# Altium schematic sheet Sheet2.SchDoc
size A4
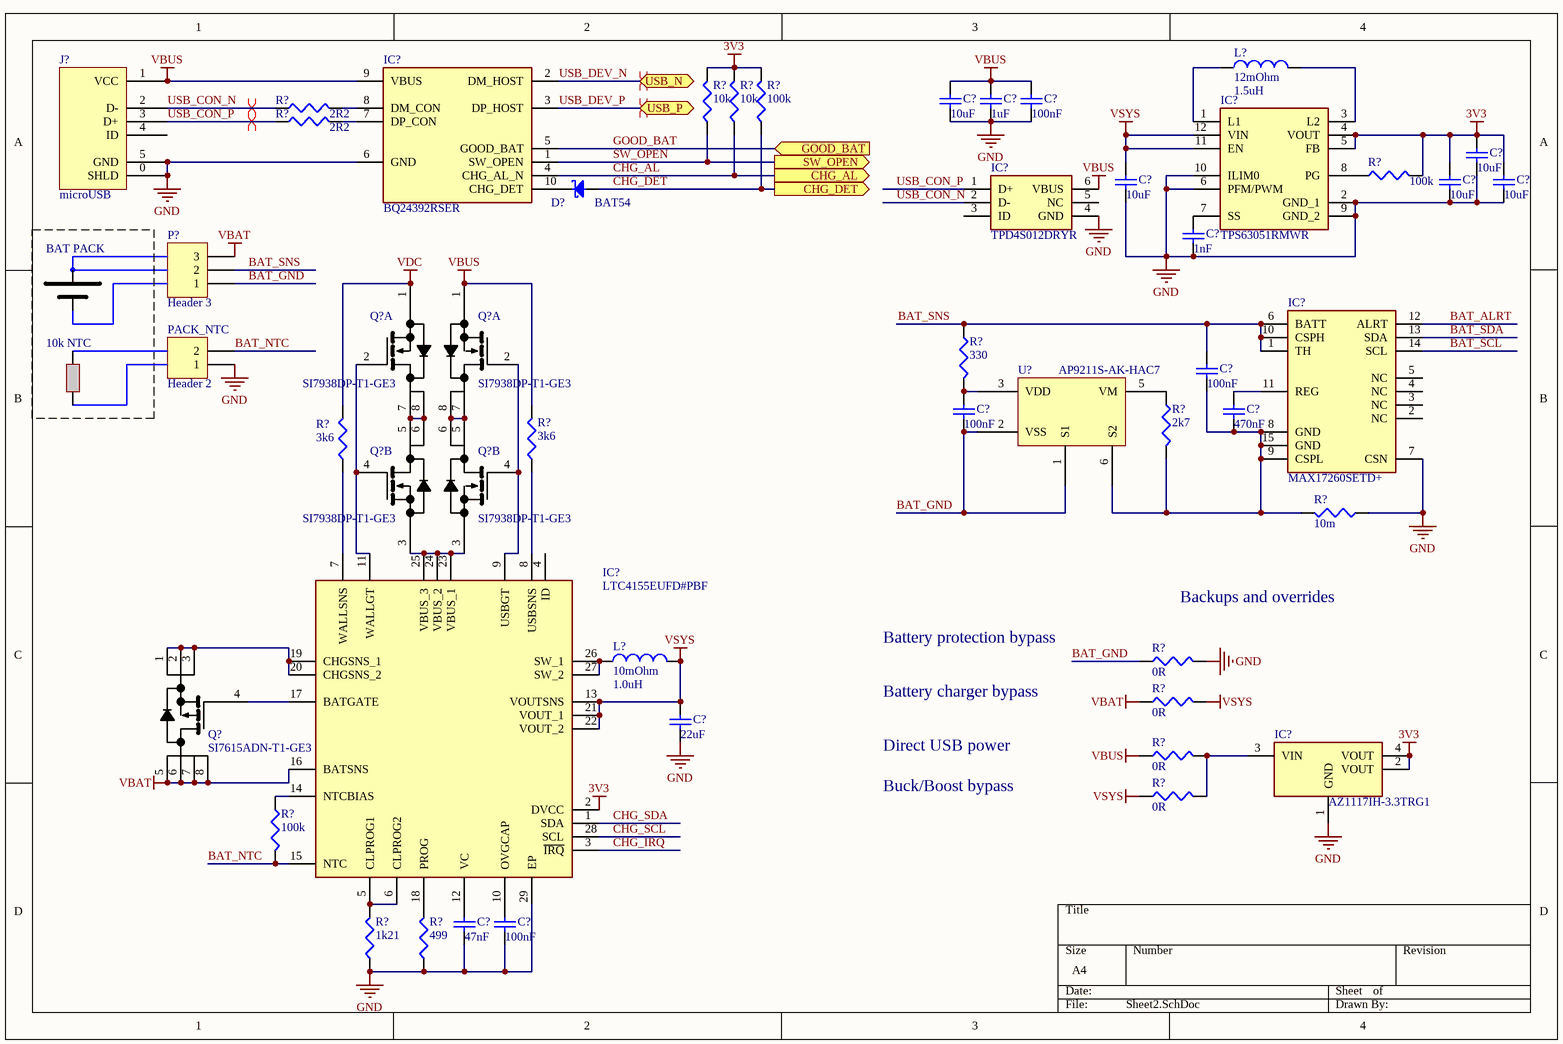
[diagram p0: Sheet2.SchDoc]

## Parts
(Parts that share a designator on the sheet are numbered #1, #2 ... from top to bottom, then left to right.)
C?#1  value 10uF  [1608[0603]]  (hidden comment: Cap Semi)
C?#2  value 1uF  [1608[0603]]  (hidden comment: Cap Semi)
C?#3  value 100nF  [1608[0603]]  (hidden comment: Cap Semi)
C?#4  value 10uF  [1608[0603]]  (hidden comment: Cap Semi)
C?#5  value 10uF  [1608[0603]]  (hidden comment: Cap Semi)
C?#6  value 10uF  [1608[0603]]  (hidden comment: Cap Semi)
C?#7  value 10uF  [1608[0603]]  (hidden comment: Cap Semi)
C?#8  value 1nF  [1608[0603]]  (hidden comment: Cap Semi)
C?#9  value 100nF  [1608[0603]]  (hidden comment: Cap Semi)
C?#10  value 100nF  [1608[0603]]  (hidden comment: Cap Semi)
C?#11  value 470nF  [1608[0603]]  (hidden comment: Cap Semi)
C?#12  value 22uF  [1608[0603]]  (hidden comment: Cap Semi)
C?#13  value 47nF  [1608[0603]]  (hidden comment: Cap Semi)
C?#14  value 100nF  [1608[0603]]  (hidden comment: Cap Semi)
D?  BAT54  [SOT95P240X130-3N]
IC?#1  BQ24392RSER  [RSE(R-PUQFN-N10)]
IC?#2  TPS63051RMWR  [QFN50P250X250X100-12N-D]
IC?#3  TPD4S012DRYR  [SON50P100X145X60-6N]
IC?#4  MAX17260SETD+  [SON40P300X300X80-15N]
IC?#5  LTC4155EUFD#PBF  [QFN50P400X500X80-29N-D]
IC?#6  AZ1117IH-3.3TRG1  [SOT230P700X170-4N]
J?  microUSB  [UB-MC5BR3-SDWP604-4S - custom]
L?#1  12mOhm  value 1.5uH  [INDP2523X23N]
L?#2  10mOhm  value 1.0uH  [INDP2523X23N]
P?  Header 3  [HDR1X3]
PACK_NTC  Header 2  [HDR1X2]
Q?#1  SI7938DP-T1-GE3  [POWERPAK-SO8_1]  (part A of 2)
Q?#2  SI7938DP-T1-GE3  [POWERPAK-SO8_1]  (part A of 2)
Q?#3  SI7938DP-T1-GE3  [POWERPAK-SO8_1]  (part B of 2)
Q?#4  SI7938DP-T1-GE3  [POWERPAK-SO8_1]  (part B of 2)
Q?#5  SI7615ADN-T1-GE3  [PowerPAK1212-8 Single]
R?#1  value 2R2  [J1-0603]  (hidden comment: Res3)
R?#2  value 2R2  [J1-0603]  (hidden comment: Res3)
R?#3  value 10k  [J1-0603]  (hidden comment: Res3)
R?#4  value 10k  [J1-0603]  (hidden comment: Res3)
R?#5  value 100k  [J1-0603]  (hidden comment: Res3)
R?#6  value 100k  [J1-0603]  (hidden comment: Res3)
R?#7  value 330  [J1-0603]  (hidden comment: Res3)
R?#8  value 2k7  [J1-0603]  (hidden comment: Res3)
R?#9  value 3k6  [J1-0603]  (hidden comment: Res3)
R?#10  value 3k6  [J1-0603]  (hidden comment: Res3)
R?#11  value 10m  [RESC3216X80N]  (hidden comment: Res3)
R?#12  value 0R  [J1-0603]  (hidden comment: Res3)
R?#13  value 0R  [J1-0603]  (hidden comment: Res3)
R?#14  value 0R  [J1-0603]  (hidden comment: Res3)
R?#15  value 0R  [J1-0603]  (hidden comment: Res3)
R?#16  value 100k  [J1-0603]  (hidden comment: Res3)
R?#17  value 1k21  [J1-0603]  (hidden comment: Res3)
R?#18  value 499  [J1-0603]  (hidden comment: Res3)
U?  AP9211S-AK-HAC7  [U-DFN2030-6]

## Ports
CHG_AL (out), CHG_DET (out), GOOD_BAT (in), SW_OPEN (out), USB_N (bidir), USB_P (bidir)

## Nets
3V3: C?#4.2 C?#6.2 C?#7.2 IC?#2.4(VOUT) IC?#2.5(FB) IC?#5.2(DVCC) IC?#6.2(VOUT) IC?#6.4(VOUT) R?#3.2 R?#4.2 R?#5.2 R?#6.2
GND: C?#1.1 C?#2.1 C?#3.1 C?#4.1 C?#5.1 C?#6.1 C?#7.1 C?#8.1 C?#12.1 C?#13.1 C?#14.1 IC?#1.6(GND) IC?#2.2(GND_1) IC?#2.6(PFM/PWM) IC?#2.9(GND_2) IC?#2.10(ILIM0) IC?#3.4(GND) IC?#4.7(CSN) IC?#5.29(EP) IC?#6.1(GND) J?.0(SHLD) J?.5(GND) PACK_NTC.1 R?#11.1 R?#12.2 R?#17.1 R?#18.1
VBAT: IC?#5.16(BATSNS) P?.3 Q?#5.5(D) Q?#5.6(D) Q?#5.7(D) Q?#5.8(D) R?#13.1
VBUS: C?#1.2 C?#2.2 C?#3.2 IC?#1.9(VBUS) IC?#3.6(VBUS) J?.1(VCC) Q?#2.1(S1) R?#10.2 R?#14.1
VDC: Q?#1.1(S1) R?#9.2
VSYS: C?#5.2 C?#12.2 IC?#2.11(EN) IC?#2.12(VIN) IC?#5.13(VOUTSNS) IC?#5.21(VOUT_1) IC?#5.22(VOUT_2) L?#2.2 R?#13.2 R?#15.1
BAT_ALRT: IC?#4.12(ALRT)
BAT_GND: C?#10.1 P?.1 R?#12.1 U?.1(S1) U?.2(VSS)
BAT_NTC: IC?#5.15(NTC) PACK_NTC.2 R?#16.2
BAT_SCL: IC?#4.14(SCL)
BAT_SDA: IC?#4.13(SDA)
BAT_SNS: C?#9.2 IC?#4.1(TH) IC?#4.6(BATT) IC?#4.10(CSPH) P?.2 R?#7.1
CHG_AL: IC?#1.4(CHG_AL_N) R?#4.1 ; port CHG_AL
CHG_DET: D?.1(A) R?#5.1 ; port CHG_DET
CHG_IRQ: IC?#5.3(~{IRQ})
CHG_SCL: IC?#5.28(SCL)
CHG_SDA: IC?#5.1(SDA)
GOOD_BAT: IC?#1.5(GOOD_BAT) ; port GOOD_BAT
SW_OPEN: IC?#1.1(SW_OPEN) R?#3.1 ; port SW_OPEN
USB_CON_N: IC?#3.2(D-) J?.2(D-) R?#1.1
USB_CON_P: IC?#3.1(D+) J?.3(D+) R?#2.1
USB_DEV_N: IC?#1.2(DM_HOST) ; port USB_N
USB_DEV_P: IC?#1.3(DP_HOST) ; port USB_P
NetC?#8_2: C?#8.2 IC?#2.7(SS)
NetC?#9_1: C?#9.1 C?#11.1 IC?#4.8(GND) IC?#4.9(CSPL) IC?#4.15(GND) R?#8.2 R?#11.2 U?.6(S2)
NetC?#10_2: C?#10.2 R?#7.2 U?.3(VDD)
NetC?#11_2: C?#11.2 IC?#4.11(REG)
NetC?#13_2: C?#13.2 IC?#5.12(VC)
NetC?#14_2: C?#14.2 IC?#5.10(OVGCAP)
NetD?_3: D?.3(C) IC?#1.10(CHG_DET)
NetIC?#1_7: IC?#1.7(DP_CON) R?#2.2
NetIC?#1_8: IC?#1.8(DM_CON) R?#1.2
NetIC?#2_1: IC?#2.1(L1) L?#1.1
NetIC?#2_3: IC?#2.3(L2) L?#1.2
NetIC?#2_8: IC?#2.8(PG) R?#6.1
NetIC?#5_5: IC?#5.5(CLPROG1) IC?#5.6(CLPROG2) R?#17.2
NetIC?#5_7: IC?#5.7(WALLSNS) R?#9.1
NetIC?#5_8: IC?#5.8(USBSNS) R?#10.1
NetIC?#5_9: IC?#5.9(USBGT) Q?#2.2(G1) Q?#4.4(G2)
NetIC?#5_11: IC?#5.11(WALLGT) Q?#1.2(G1) Q?#3.4(G2)
NetIC?#5_14: IC?#5.14(NTCBIAS) R?#16.1
NetIC?#5_17: IC?#5.17(BATGATE) Q?#5.4(G)
NetIC?#5_18: IC?#5.18(PROG) R?#18.2
NetIC?#5_19: IC?#5.19(CHGSNS_1) IC?#5.20(CHGSNS_2) Q?#5.1(S) Q?#5.2(S) Q?#5.3(S)
NetIC?#5_23: IC?#5.23(VBUS_1) IC?#5.24(VBUS_2) IC?#5.25(VBUS_3) Q?#3.3(S2) Q?#4.3(S2)
NetIC?#5_26: IC?#5.26(SW_1) IC?#5.27(SW_2) L?#2.1
NetIC?#6_3: IC?#6.3(VIN) R?#14.2 R?#15.2
NetQ?#1_7: Q?#1.7(D1_1) Q?#1.8(D1_2) Q?#3.5(D2_1) Q?#3.6(D2_2)
NetQ?#2_7: Q?#2.7(D1_1) Q?#2.8(D1_2) Q?#4.5(D2_1) Q?#4.6(D2_2)
NetR?#8_1: R?#8.1 U?.5(VM)

Not connected (* = marked no-connect by the designer): IC?#3 3(ID) 5(NC); IC?#4 2(NC) 3(NC) 4(NC) 5(NC); IC?#5 4(ID); J? 4(ID)

## Layout directives
differential pair: USB_CON_N, USB_CON_P, USB_DEV_N, USB_DEV_P

## Notes on the sheet
- BAT PACK
- 10k NTC
- Battery protection bypass
- Backups and overrides
- Battery charger bypass
- Direct USB power
- Buck/Boost bypass

## Library data of the parts
C?#1-C?#14 = Cap Semi: Capacitor (Semiconductor SIM Model); Published: 8-Jun-2000; LatestRevisionDate: 29-May-2009; LatestRevisionNote: IPC-7351 Footprint Added.; PackageReference: C1206; Publisher: Altium Limited; PackageDescription: Chip Capacitor
D? = BAT54: Diode Schottky  Anode Pin 1 Cathode Pin 3 (Pas de pin 2); Part Description: Single Small Signal Schottky Diode; Manufacturer: FAIRCHILD SEMICONDUCTOR; Voltage: 30V; Power: 200mA; PressFit: No; Bonding: No; Part Number: BAT54; Component Kind: Standard; Component Type: Standard; Device: BAT54; PackageDescription: SOT23 3-Leads, Pitch 0.95mm - Body 1.3x2.9mm, IPC Medium Density; Manufacturer Part Number: BAT54; Pin Count: 3; Case: SOT23-3; Mounted: Yes; Socket: No; SMD: Yes; Sense: No; ComponentHeight: 1.30mm; HelpURL: \\cern.ch\dfs\Applications\Altium\Datasheets\BAT54.pdf; Author: CERN DEM JLC; CreateDate: 17.09.2009; LatestRevisionDate: 27.05.2010
IC?#1 = BQ24392RSER: Integrated Circuit; Manufacturer_Name: Texas Instruments; Datasheet Link: http://www.ti.com/lit/gpn/bq24392; Manufacturer_Part_Number: BQ24392RSER; Mouser Part Number: 595-BQ24392RSER; Mouser Price/Stock: https://www.mouser.com/Search/Refine.aspx?Keyword=595-BQ24392RSER; RS Part Number: 8279327; RS Price/Stock: http://uk.rs-online.com/web/p/products/8279327
IC?#2 = TPS63051RMWR: Integrated Circuit; Manufacturer_Name: Texas Instruments; Datasheet Link: http://www.ti.com/lit/gpn/tps63051; Height: 1mm; Manufacturer_Part_Number: TPS63051RMWR; ComponentLink1Description: TPS6305x Datasheet; ComponentLink1URL: http://www.ti.com/lit/ds/symlink/tps63051.pdf
IC?#3 = TPD4S012DRYR: Integrated Circuit; Manufacturer_Name: Texas Instruments; Datasheet Link: http://www.ti.com/lit/ds/symlink/tpd4s012.pdf; Height: 0.6mm; Mouser2 Part Number: 595-TPD4S012DRYR; Mouser2 Price/Stock: https://www.mouser.com/Search/Refine.aspx?Keyword=595-TPD4S012DRYR; Manufacturer_Part_Number: TPD4S012DRYR; ComponentLink1Description: TPD4S012 Datasheet; ComponentLink1URL: http://www.ti.com/lit/ds/symlink/tpd4s012.pdf
IC?#4 = MAX17260SETD+: Integrated Circuit; Manufacturer_Name: Maxim Integrated; Datasheet Link: https://componentsearchengine.com/Datasheets/1/MAX17260SETD+.pdf; Height: 0.8mm; Mouser2 Part Number: 700-MAX17260SETD+; Mouser2 Price/Stock: https://www.mouser.com/Search/Refine.aspx?Keyword=700-MAX17260SETD%2B; Manufacturer_Part_Number: MAX17260SETD+; ComponentLink1Description: MAX17260 Datasheet; ComponentLink1URL: https://datasheets.maximintegrated.com/en/ds/MAX17260.pdf; ComponentLink2Description: MAX17260SETD+ (Mouser); ComponentLink2URL: https://pl.mouser.com/ProductDetail/Maxim-Integrated/MAX17260SETD%2b?qs=sGAEpiMZZMve4%2FbfQkoj%252BAnnYqGcWj2a8PZHpMVmFSA%3D; ComponentLink3Description: MAX17260 User Guide; ComponentLink3URL: https://pdfserv.maximintegrated.com/en/an/MAX1726x-ModelGauge-m5-EZ-user-guide.pdf
IC?#5 = LTC4155EUFD#PBF: Integrated Circuit; Manufacturer_Name: Linear Technology; Datasheet Link: http://www.analog.com/media/en/technical-documentation/data-sheets/4155fd.pdf; Height: 0.8mm; Manufacturer_Part_Number: LTC4155EUFD#PBF
IC?#6 = AZ1117IH-3.3TRG1: Integrated Circuit; Manufacturer_Name: Diodes Inc.; Description: LDO Voltage Regulators LDO BJT HiCurr 1.35A 10Hz to 10KHz; Datasheet Link: https://componentsearchengine.com/Datasheets/1/AZ1117IH-3.3TRG1.pdf; Height: 1.7mm; Mouser2 Part Number: 621-AZ1117IH-3.3TRG1; Mouser2 Price/Stock: https://www.mouser.com/Search/Refine.aspx?Keyword=621-AZ1117IH-3.3TRG1; Manufacturer_Part_Number: AZ1117IH-3.3TRG1
J? = microUSB: microUSB connector
L?#1 = Inductor: Inductor SRN6045TA-1R5Y; Code_IEC: 1005; Published: 8-Jun-2000; LatestRevisionDate: 29-May-2009; LatestRevisionNote: IPC-7351 Footprint Added.; PackageReference: 0402-A; Publisher: Altium Limited; PackageDescription: Chip Inductor; Code_JEITA: 0402; ComponentLink1Description: SRN6045TA-1R5Y (Mouser); ComponentLink1URL: https://pl.mouser.com/ProductDetail/Bourns/SRN6045TA-1R5Y?qs=sGAEpiMZZMsg%252By3WlYCkU3tyM9HcjVri8VL%2FIY%252BgGEQ%3D
L?#2 = Inductor: Inductor SRN6045TA-1R0Y; Code_IEC: 1005; Published: 8-Jun-2000; LatestRevisionDate: 29-May-2009; LatestRevisionNote: IPC-7351 Footprint Added.; PackageReference: 0402-A; Publisher: Altium Limited; PackageDescription: Chip Inductor; Code_JEITA: 0402; ComponentLink2Description: SRN6045-1R0Y (Mouser); ComponentLink2URL: pl.mouser.com/ProductDetail/Bourns/SRN6045-1R0Y?qs=sGAEpiMZZMsg%252By3WlYCkU0o4wAoqWTm0KET%2FFU%252BpntA%3D
P? = Header 3: Header, 3-Pin; LatestRevisionDate: 17-Jul-2002; LatestRevisionNote: Re-released for DXP Platform.; Publisher: Altium Limited
PACK_NTC = Header 2: Header, 2-Pin; LatestRevisionDate: 17-Jul-2002; LatestRevisionNote: Re-released for DXP Platform.; Publisher: Altium Limited
Q?#1-Q?#4 = SI7938DP-T1-GE3: MOSFET (N-Channel); Manufacturer_Name: Vishay; Datasheet Link: https://www.vishay.com/docs/65365/si7938dp.pdf; Manufacturer_Part_Number: SI7938DP-T1-GE3
Q?#5 = SI7615ADN-T1-GE3: MOSFET (P-Channel); Manufacturer_Name: Vishay; Manufacturer_Part_Number: SIS413DN-T1-GE3; ComponentLink1Description: Mouser; ComponentLink1URL: https://pl.mouser.com/ProductDetail/Vishay-Siliconix/SI7615ADN-T1-GE3?qs=sGAEpiMZZMshyDBzk1%2FWi6E1PdrpaYNpUmwK%2FZj1bgw%3D; ComponentLink2Description: Datasheet; ComponentLink2URL: https://pl.mouser.com/datasheet/2/427/si7615cdn-1018932.pdf
R?#1-R?#18 = Res3: Resistor; Published: 8-Jun-2000; LatestRevisionDate: 29-May-2009; LatestRevisionNote: IPC-7351 Footprint Added.; PackageReference: J1-0603; Publisher: Altium Limited; PackageDescription: Chip Resistor
U? = AP9211: SINGLE CHIP SOLUTION FOR 1-CELL Li+ BATTERY PACK; ComponentLink1Description: AP9211S-AK-HAC-7 (Mouser); ComponentLink1URL: https://pl.mouser.com/ProductDetail/Diodes-Incorporated/AP9211S-AK-HAC-7?qs=%2Fha2pyFaduhU8ORG8s%252BdQ8ce%2FFXbiZtTJujjlGEM9Y4G1qKWx8axSg%3D%3D; ComponentLink2Description: AP9211 Datasheet; ComponentLink2URL: https://www.diodes.com/assets/Datasheets/AP9211.pdf